# Altium project Analog_Daugther_MAX11331_6U_1v02.PrjPcb (part 2 of 2)

## Sheet Opamps.SchDoc
size A4; Author: Thomas Kreppel; CompanyName: Universidad de Santiago de Chile; Address1: Avenida Ecuador Nº 3519; Address2: Estación Central, Santiago; Address3: Chile; DocumentNumber: 4; Revision: 1v02; SheetNumber: 4; SheetTotal: 6
Used 8 times, as channels OpAmp1, OpAmp2, OpAmp3, OpAmp4, OpAmp5, OpAmp6, OpAmp7, OpAmp8. Parts and nets are listed once, with the designators drawn on the sheet.
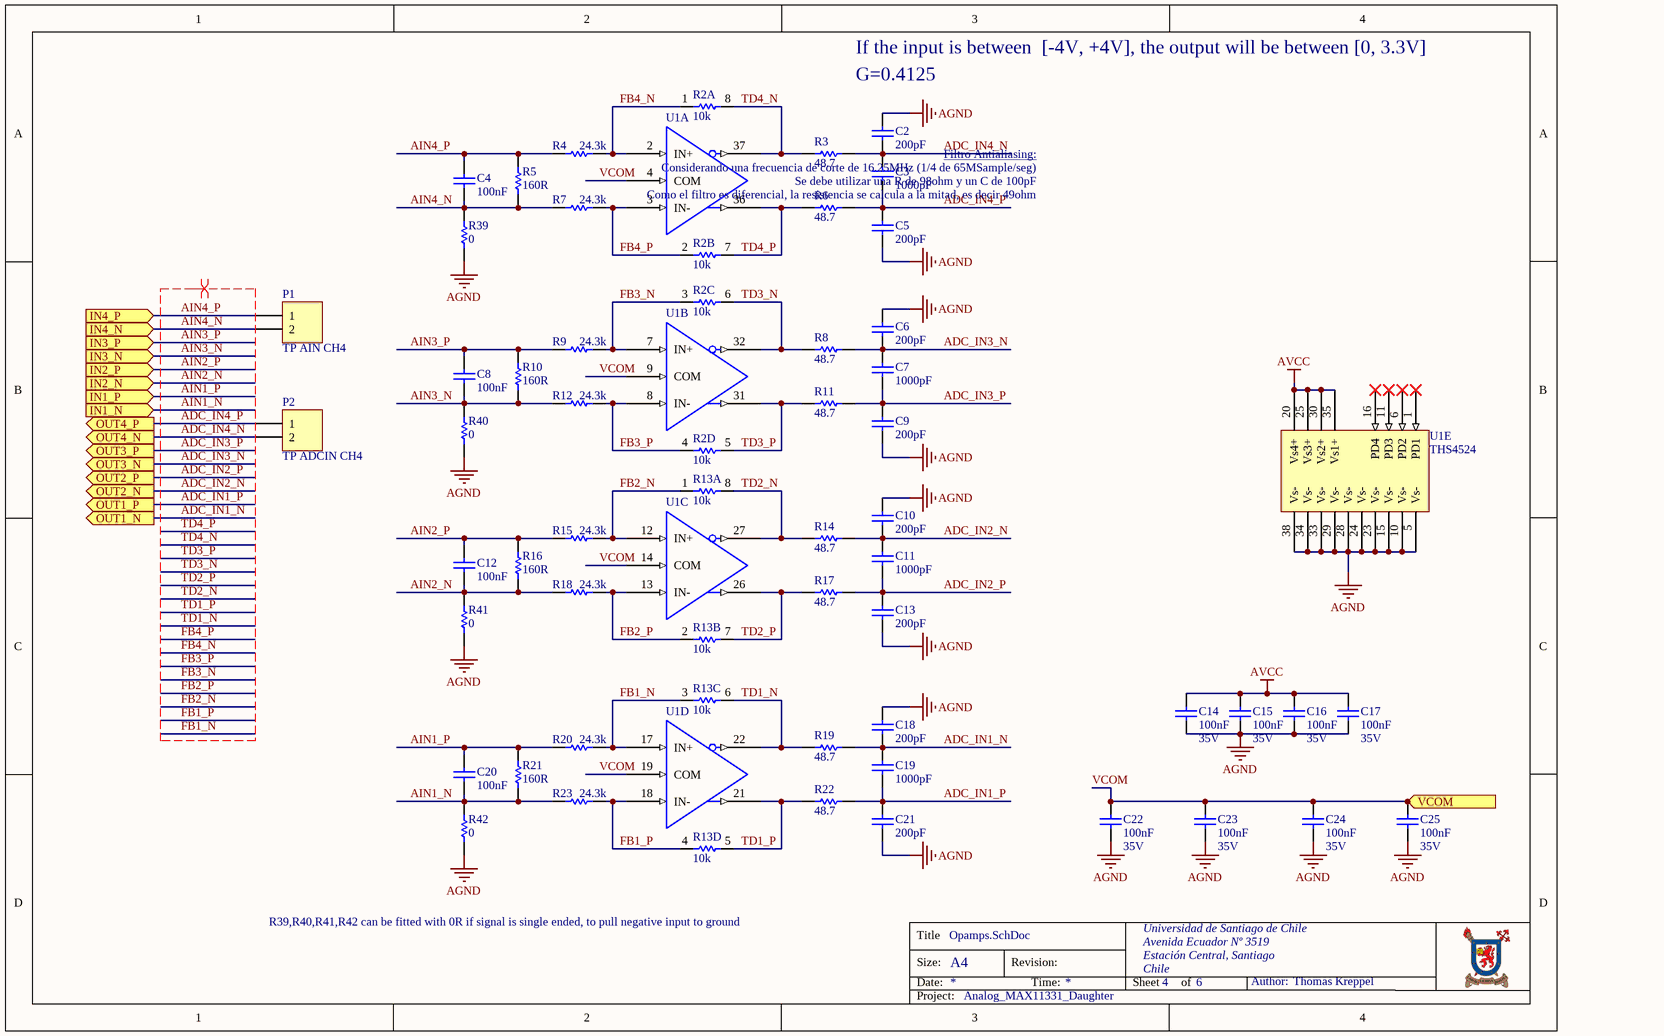
[diagram p5: Opamps.SchDoc]

### Parts
C2  200pF  [CAP_0603]
C3  1000pF  [CAP_0603]
C4  100nF  [RES_1206]
C5  200pF  [CAP_0603]
C6  200pF  [CAP_0603]
C7  1000pF  [CAP_0603]
C8  100nF  [RES_1206]
C9  200pF  [CAP_0603]
C10  200pF  [CAP_0603]
C11  1000pF  [CAP_0603]
C12  100nF  [RES_1206]
C13  200pF  [CAP_0603]
C14  100nF  Voltage: 35V  [CAP_0603]
C15  100nF  Voltage: 35V  [CAP_0603]
C16  100nF  Voltage: 35V  [CAP_0603]
C17  100nF  Voltage: 35V  [CAP_0603]
C18  200pF  [CAP_0603]
C19  1000pF  [CAP_0603]
C20  100nF  [RES_1206]
C21  200pF  [CAP_0603]
C22  100nF  Voltage: 35V  [CAP_0603]
C23  100nF  Voltage: 35V  [CAP_0603]
C24  100nF  Voltage: 35V  [CAP_0603]
C25  100nF  Voltage: 35V  [CAP_0603]
P1  TP AIN CH4  [HDR1X2]  (no BOM)
P2  TP ADCIN CH4  [HDR1X2]  (no BOM)
R2  10k  [CAC-80P320X160-8N]  (parts A,B,C,D of 4)
R3  48.7  [RES_0603]
R4  24.3k  [RES_0603]
R5  160R  [RES_1206]
R6  48.7  [RES_0603]
R7  24.3k  [RES_0603]
R8  48.7  [RES_0603]
R9  24.3k  [RES_0603]
R10  160R  [RES_1206]
R11  48.7  [RES_0603]
R12  24.3k  [RES_0603]
R13  10k  [CAC-80P320X160-8N]  (parts A,B,C,D of 4)
R14  48.7  [RES_0603]
R15  24.3k  [RES_0603]
R16  160R  [RES_1206]
R17  48.7  [RES_0603]
R18  24.3k  [RES_0603]
R19  48.7  [RES_0603]
R20  24.3k  [RES_0603]
R21  160R  [RES_1206]
R22  48.7  [RES_0603]
R23  24.3k  [RES_0603]
R39  0  [RES_0603]
R40  0  [RES_0603]
R41  0  [RES_0603]
R42  0  [RES_0603]
U1  THS4524  [THS4524 Footprint]  (value not drawn)  (parts A,B,C,D,E of 5)

### Ports
IN1_N (in), IN1_P (in), IN2_N (in), IN2_P (in), IN3_N (in), IN3_P (in), IN4_N (in), IN4_P (in), OUT1_N (out), OUT1_P (out), OUT2_N (out), OUT2_P (out), OUT3_N (out), OUT3_P (out), OUT4_N (out), OUT4_P (out), VCOM (in)

### Nets
AGND: C2.1 C5.2 C6.1 C9.2 C10.1 C13.2 C14.2 C15.2 C16.2 C17.2 C18.1 C21.2 C22.1 C23.1 C24.1 C25.1 R39.2 R40.2 R41.2 R42.2 U1.5(Vs-) U1.10(Vs-) U1.15(Vs-) U1.23(Vs-) U1.24(Vs-) U1.28(Vs-) U1.29(Vs-) U1.33(Vs-) U1.34(Vs-) U1.38(Vs-)
AVCC: C14.1 C15.1 C16.1 C17.1 U1.20(Vs4+) U1.25(Vs3+) U1.30(Vs2+) U1.35(Vs1+)
ADC_IN1_N: C18.2 C19.1 R19.1 ; port OUT1_N
ADC_IN1_P: C19.2 C21.1 R22.1 ; port OUT1_P
ADC_IN2_N: C10.2 C11.1 R14.1 ; port OUT2_N
ADC_IN2_P: C11.2 C13.1 R17.1 ; port OUT2_P
ADC_IN3_N: C6.2 C7.1 R8.1 ; port OUT3_N
ADC_IN3_P: C7.2 C9.1 R11.1 ; port OUT3_P
ADC_IN4_N: C2.2 C3.1 P2.2 R3.1 ; port OUT4_N
ADC_IN4_P: C3.2 C5.1 P2.1 R6.1 ; port OUT4_P
AIN1_N: C20.2 R21.2 R23.2 R42.1 ; port IN1_N
AIN1_P: C20.1 R20.2 R21.1 ; port IN1_P
AIN2_N: C12.2 R16.2 R18.2 R41.1 ; port IN2_N
AIN2_P: C12.1 R15.2 R16.1 ; port IN2_P
AIN3_N: C8.2 R10.2 R12.2 R40.1 ; port IN3_N
AIN3_P: C8.1 R9.2 R10.1 ; port IN3_P
AIN4_N: C4.2 P1.2 R5.2 R7.2 R39.1 ; port IN4_N
AIN4_P: C4.1 P1.1 R4.2 R5.1 ; port IN4_P
FB1_N: R13.3 R20.1 U1.17(IN+)
FB1_P: R13.4 R23.1 U1.18(IN-)
FB2_N: R13.1 R15.1 U1.12(IN+)
FB2_P: R13.2 R18.1 U1.13(IN-)
FB3_N: R2.3 R9.1 U1.7(IN+)
FB3_P: R2.4 R12.1 U1.8(IN-)
FB4_N: R2.1 R4.1 U1.2(IN+)
FB4_P: R2.2 R7.1 U1.3(IN-)
TD1_N: R13.6 R19.2 U1.22(OUT-)
TD1_P: R13.5 R22.2 U1.21(OUT+)
TD2_N: R13.8 R14.2 U1.27(OUT-)
TD2_P: R13.7 R17.2 U1.26(OUT+)
TD3_N: R2.6 R8.2 U1.32(OUT-)
TD3_P: R2.5 R11.2 U1.31(OUT+)
TD4_N: R2.8 R3.2 U1.37(OUT-)
TD4_P: R2.7 R6.2 U1.36(OUT+)
VCOM: C22.2 C23.2 C24.2 C25.2 U1.4(COM) U1.9(COM) U1.14(COM) U1.19(COM) ; port VCOM

Not connected (* = marked no-connect by the designer): U1 1(PD1)* 6(PD2)* 11(PD3)* 16(PD4)*

### Channels
OpAmp1: designators end in A; ports IN1_N=AIN1_N IN1_P=AIN1_P IN2_N=AIN2_N IN2_P=AIN2_P IN3_N=AIN3_N IN3_P=AIN3_P IN4_N=AIN4_N IN4_P=AIN4_P OUT1_N=ADC_IN1_N OUT1_P=ADC_IN1_P OUT2_N=ADC_IN2_N OUT2_P=ADC_IN2_P OUT3_N=ADC_IN3_N OUT3_P=ADC_IN3_P OUT4_N=ADC_IN4_N OUT4_P=ADC_IN4_P VCOM=VCOM
OpAmp2: designators end in B; ports IN1_N=AIN1_N IN1_P=AIN1_P IN2_N=AIN2_N IN2_P=AIN2_P IN3_N=AIN3_N IN3_P=AIN3_P IN4_N=AIN4_N IN4_P=AIN4_P OUT1_N=ADC_IN1_N OUT1_P=ADC_IN1_P OUT2_N=ADC_IN2_N OUT2_P=ADC_IN2_P OUT3_N=ADC_IN3_N OUT3_P=ADC_IN3_P OUT4_N=ADC_IN4_N OUT4_P=ADC_IN4_P VCOM=VCOM
OpAmp3: designators end in C; ports IN1_N=AIN1_N IN1_P=AIN1_P IN2_N=AIN2_N IN2_P=AIN2_P IN3_N=AIN3_N IN3_P=AIN3_P IN4_N=AIN4_N IN4_P=AIN4_P OUT1_N=ADC_IN1_N OUT1_P=ADC_IN1_P OUT2_N=ADC_IN2_N OUT2_P=ADC_IN2_P OUT3_N=ADC_IN3_N OUT3_P=ADC_IN3_P OUT4_N=ADC_IN4_N OUT4_P=ADC_IN4_P VCOM=VCOM
OpAmp4: designators end in D; ports IN1_N=AIN1_N IN1_P=AIN1_P IN2_N=AIN2_N IN2_P=AIN2_P IN3_N=AIN3_N IN3_P=AIN3_P IN4_N=AIN4_N IN4_P=AIN4_P OUT1_N=ADC_IN1_N OUT1_P=ADC_IN1_P OUT2_N=ADC_IN2_N OUT2_P=ADC_IN2_P OUT3_N=ADC_IN3_N OUT3_P=ADC_IN3_P OUT4_N=ADC_IN4_N OUT4_P=ADC_IN4_P VCOM=VCOM
OpAmp5: designators end in E; ports IN1_N=AIN1_N IN1_P=AIN1_P IN2_N=AIN2_N IN2_P=AIN2_P IN3_N=AIN3_N IN3_P=AIN3_P IN4_N=AIN4_N IN4_P=AIN4_P OUT1_N=ADC_IN1_N OUT1_P=ADC_IN1_P OUT2_N=ADC_IN2_N OUT2_P=ADC_IN2_P OUT3_N=ADC_IN3_N OUT3_P=ADC_IN3_P OUT4_N=ADC_IN4_N OUT4_P=ADC_IN4_P VCOM=VCOM
OpAmp6: designators end in F; ports IN1_N=AIN1_N IN1_P=AIN1_P IN2_N=AIN2_N IN2_P=AIN2_P IN3_N=AIN3_N IN3_P=AIN3_P IN4_N=AIN4_N IN4_P=AIN4_P OUT1_N=ADC_IN1_N OUT1_P=ADC_IN1_P OUT2_N=ADC_IN2_N OUT2_P=ADC_IN2_P OUT3_N=ADC_IN3_N OUT3_P=ADC_IN3_P OUT4_N=ADC_IN4_N OUT4_P=ADC_IN4_P VCOM=VCOM
OpAmp7: designators end in G; ports IN1_N=AIN1_N IN1_P=AIN1_P IN2_N=AIN2_N IN2_P=AIN2_P IN3_N=AIN3_N IN3_P=AIN3_P IN4_N=AIN4_N IN4_P=AIN4_P OUT1_N=ADC_IN1_N OUT1_P=ADC_IN1_P OUT2_N=ADC_IN2_N OUT2_P=ADC_IN2_P OUT3_N=ADC_IN3_N OUT3_P=ADC_IN3_P OUT4_N=ADC_IN4_N OUT4_P=ADC_IN4_P VCOM=VCOM
OpAmp8: designators end in H; ports IN1_N=AIN1_N IN1_P=AIN1_P IN2_N=AIN2_N IN2_P=AIN2_P IN3_N=AIN3_N IN3_P=AIN3_P IN4_N=AIN4_N IN4_P=AIN4_P OUT1_N=ADC_IN1_N OUT1_P=ADC_IN1_P OUT2_N=ADC_IN2_N OUT2_P=ADC_IN2_P OUT3_N=ADC_IN3_N OUT3_P=ADC_IN3_P OUT4_N=ADC_IN4_N OUT4_P=ADC_IN4_P VCOM=VCOM

### Layout directives
differential pair: ADC_IN1_N, ADC_IN1_P, ADC_IN2_N, ADC_IN2_P, ADC_IN3_N, ADC_IN3_P, ADC_IN4_N, ADC_IN4_P, AIN1_N, AIN1_P, AIN2_N, AIN2_P, AIN3_N, AIN3_P, AIN4_N, AIN4_P, FB1_N, FB1_P, FB2_N, FB2_P, FB3_N, FB3_P, FB4_N, FB4_P, TD1_N, TD1_P, TD2_N, TD2_P, TD3_N, TD3_P, TD4_N, TD4_P

### Notes on the sheet
- (near C2) G=0.4125
- If the input is between  [-4V, +4V], the output will be between [0, 3.3V]
- Considerando una frecuencia de corte de 16.25MHz (1/4 de 65MSample/seg)
- Se debe utilizar una R de 98ohm y un C de 100pF
- Filtro Antialiasing:
- Como el filtro es diferencial, la resistencia se calcula a la mitad, es decir 49ohm
- R39,R40,R41,R42 can be fitted with 0R if signal is single ended, to pull negative input to ground
- Title
- Size:
- Date:
- A4
- Revision:
- Time:
- Sheet
- of
- Author:
- Project:

### Library data of the parts
C2 C5 C6 C9 C10 C13 C18 C21 = Cap_0603: Capacitor; MPN: 0603N201J500CT; Rule: PcbType=ProtelPcb; MF: Walsin; Voltage: 16V; Dielectricum: CG0; Tolerance: 5%; Published: 8-Jun-2000; LatestRevisionDate: 17-Jul-2002; LatestRevisionNote: Re-released for DXP Platform.; PackageReference: RAD-0.3; Publisher: Altium Limited; Value: 200pF; Supplier Part Number 1: 1292-1499-1-ND; Supplier 1: Digikey; Package: 0603; LCSC Part Number: C458897
C3 C7 C11 C19 = Cap_0603: Capacitor; MPN: 885012006029; Rule: PcbType=ProtelPcb; MF: Würth Elektronik; Voltage: 16V; Dielectricum: CG0; Tolerance: 5%; Published: 8-Jun-2000; LatestRevisionDate: 17-Jul-2002; LatestRevisionNote: Re-released for DXP Platform.; PackageReference: RAD-0.3; Publisher: Altium Limited; Value: 1000pF; Supplier Part Number 1: 732-7771-1-ND; Supplier 1: Digikey; Package: 0603; LCSC Part Number: C6715067
C4 C8 C12 C20 = Cap_1206: Capacitor; MPN: C1206C104K3RACTU; Voltage: 16V; MF: KEMET; Dielectricum: X7R; Tolerance: 10%; Supplier Part Number 1: 399-8140-1-ND; Value: 100nF; Supplier 1: Digikey; Package: 1206; LCSC Part Number: C2168906
C14-C17 C22-C25 = Cap_0603: Capacitor; MPN: C0603C104M5RACTU; Rule: PcbType=ProtelPcb; MF: KEMET; Dielectricum: X7R; Tolerance: 10%; Published: 8-Jun-2000; LatestRevisionDate: 17-Jul-2002; LatestRevisionNote: Re-released for DXP Platform.; PackageReference: RAD-0.3; Publisher: Altium Limited; Value: 100nF; Supplier Part Number 1: 399-7845-1-ND; Supplier 1: Digikey; Package: 0603; LCSC Part Number: C14663
P1 P2 = Header 2: Header, 2-Pin; LatestRevisionDate: 17-Jul-2002; LatestRevisionNote: Re-released for DXP Platform.; Publisher: Altium Limited
R2 R13 = ResArray 1206: Chip Resistor Array 0606, 4xR; MPN: ACASA1002S1002P100; MF: Vishay; Value: 10k; Created: Kreppel_0420; Supplier 1: Digikey; Supplier Part Number 1: 749-1023-1-ND; LCSC Part Number: C2654165
R3 R6 R8 R11 R14 R17 R19 R22 = Res0603: MPN: ERA-3AEB48R7V; MF: Panasonic; Tolerance: 0.1%; Published: 8-Jun-2000; LatestRevisionDate: 17-Jul-2002; LatestRevisionNote: Re-released for DXP Platform.; PackageReference: AXIAL-0.3; Publisher: Altium Limited; PackageDescription: Axial Device, Thru-Hole; 2 Leads; 0.3 in Pin Spacing; Supplier Part Number 1: P48.7DBCT-ND; Value: 48.7; Supplier 1: Digikey; Package: 0603; LCSC Part Number: C3951932
R4 R7 R9 R12 R15 R18 R20 R23 = Res0603: MPN: ERJ-PB3B2432V; MF: Panasonic; Tolerance: 0.1%; Published: 8-Jun-2000; LatestRevisionDate: 17-Jul-2002; LatestRevisionNote: Re-released for DXP Platform.; PackageReference: AXIAL-0.3; Publisher: Altium Limited; PackageDescription: Axial Device, Thru-Hole; 2 Leads; 0.3 in Pin Spacing; Supplier Part Number 1: P20128CT-ND; Value: 24.3k; Supplier 1: Digikey; Package: 0603; LCSC Part Number: C2087018
R5 R10 R16 R21 = Res Semi: Limiter Resistor; MPN: RT1206BRD07160RL; MF: Yageo; Tolerance: 0.1%; Published: 8-Jun-2000; LatestRevisionDate: 17-Jul-2002; LatestRevisionNote: Re-released for DXP Platform.; PackageReference: AXIAL-0.5; Publisher: Altium Limited; PackageDescription: Axial Device, Thru-Hole; 2 Leads; 0.5 in Pin Spacing; Value: 160R; Supplier Part Number 1: YAG2013CT-ND; Supplier 1: Digikey; Package: 1206; LCSC Part Number: C870442
R39-R42 = Res0603: MPN: RC0603JR-070RL; MF: Yageo; Tolerance: 1%; Published: 8-Jun-2000; LatestRevisionDate: 17-Jul-2002; LatestRevisionNote: Re-released for DXP Platform.; PackageReference: AXIAL-0.3; Publisher: Altium Limited; PackageDescription: Axial Device, Thru-Hole; 2 Leads; 0.3 in Pin Spacing; Value: 0; Supplier 1: Digikey; Supplier 2: Mouser; Supplier Part Number 1: 311-0.0GRCT-ND; Package: 0603
U1 = THS4524_1: Quad Channel fully differential Amplilfier; MF: Texas Instruments; Created: 20190720_Kreppel; MPN: THS4524; Package: TSSOP-38; Supplier 1: Digikey; Supplier Part Number 1: 296-24315-1-ND; LCSC Part Number: C2057434

## Nets that join several sheets
AGND: Analog Inputs (C1.2 R1.2), Power supplies (BS5.2 TP5.1), ADC1 (10 pins), OpAmp1 (30 pins), OpAmp2 (30 pins), ADC2 (10 pins), OpAmp3 (30 pins), OpAmp4 (30 pins), ADC3 (10 pins), ADC4 (10 pins), OpAmp5 (30 pins), OpAmp6 (30 pins), OpAmp7 (30 pins), OpAmp8 (30 pins)
AVCC: Power supplies (BS3.2 TP14.1), ADC1 (7 pins), OpAmp1 (8 pins), OpAmp2 (8 pins), ADC2 (7 pins), OpAmp3 (8 pins), OpAmp4 (8 pins), ADC3 (7 pins), ADC4 (7 pins), OpAmp5 (8 pins), OpAmp6 (8 pins), OpAmp7 (8 pins), OpAmp8 (8 pins)
DGND: Interface Connector (14 pins), Power supplies (BS4.1 TP3.1), ADC1 (C30A.2 C33A.2 C34A.2 U2A.25), ADC2 (C30B.2 C33B.2 C34B.2 U2B.25), ADC3 (C30C.2 C33C.2 C34C.2 U2C.25), ADC4 (C30D.2 C33D.2 C34D.2 U2D.25)
DVCC: Interface Connector (17 pins), Power supplies (BS2.1 D1.2), ADC1 (C33A.1 C34A.1 U2A.26), ADC2 (C33B.1 C34B.1 U2B.26), ADC3 (C33C.1 C34C.1 U2C.26), ADC4 (C33D.1 C34D.1 U2D.26)
ADC_IN1_N: ADC1 (U2A.4), OpAmp2 (C18B.2 C19B.1 R19B.1)
ADC_IN1_N: ADC1 (U2A.16), OpAmp1 (C18A.2 C19A.1 R19A.1)
ADC_IN1_N: ADC2 (U2B.4), OpAmp4 (C18D.2 C19D.1 R19D.1)
ADC_IN1_N: ADC2 (U2B.16), OpAmp3 (C18C.2 C19C.1 R19C.1)
ADC_IN1_N: ADC3 (U2C.4), OpAmp6 (C18F.2 C19F.1 R19F.1)
ADC_IN1_N: ADC3 (U2C.16), OpAmp5 (C18E.2 C19E.1 R19E.1)
ADC_IN1_N: ADC4 (U2D.4), OpAmp8 (C18H.2 C19H.1 R19H.1)
ADC_IN1_N: ADC4 (U2D.16), OpAmp7 (C18G.2 C19G.1 R19G.1)
ADC_IN1_P: ADC1 (U2A.3), OpAmp2 (C19B.2 C21B.1 R22B.1)
ADC_IN1_P: ADC1 (U2A.15), OpAmp1 (C19A.2 C21A.1 R22A.1)
ADC_IN1_P: ADC2 (U2B.3), OpAmp4 (C19D.2 C21D.1 R22D.1)
ADC_IN1_P: ADC2 (U2B.15), OpAmp3 (C19C.2 C21C.1 R22C.1)
ADC_IN1_P: ADC3 (U2C.3), OpAmp6 (C19F.2 C21F.1 R22F.1)
ADC_IN1_P: ADC3 (U2C.15), OpAmp5 (C19E.2 C21E.1 R22E.1)
ADC_IN1_P: ADC4 (U2D.3), OpAmp8 (C19H.2 C21H.1 R22H.1)
ADC_IN1_P: ADC4 (U2D.15), OpAmp7 (C19G.2 C21G.1 R22G.1)
ADC_IN2_N: ADC1 (U2A.2), OpAmp2 (C10B.2 C11B.1 R14B.1)
ADC_IN2_N: ADC1 (U2A.10), OpAmp1 (C10A.2 C11A.1 R14A.1)
ADC_IN2_N: ADC2 (U2B.2), OpAmp4 (C10D.2 C11D.1 R14D.1)
ADC_IN2_N: ADC2 (U2B.10), OpAmp3 (C10C.2 C11C.1 R14C.1)
ADC_IN2_N: ADC3 (U2C.2), OpAmp6 (C10F.2 C11F.1 R14F.1)
ADC_IN2_N: ADC3 (U2C.10), OpAmp5 (C10E.2 C11E.1 R14E.1)
ADC_IN2_N: ADC4 (U2D.2), OpAmp8 (C10H.2 C11H.1 R14H.1)
ADC_IN2_N: ADC4 (U2D.10), OpAmp7 (C10G.2 C11G.1 R14G.1)
ADC_IN2_P: ADC1 (U2A.1), OpAmp2 (C11B.2 C13B.1 R17B.1)
ADC_IN2_P: ADC1 (U2A.9), OpAmp1 (C11A.2 C13A.1 R17A.1)
ADC_IN2_P: ADC2 (U2B.1), OpAmp4 (C11D.2 C13D.1 R17D.1)
ADC_IN2_P: ADC2 (U2B.9), OpAmp3 (C11C.2 C13C.1 R17C.1)
ADC_IN2_P: ADC3 (U2C.1), OpAmp6 (C11F.2 C13F.1 R17F.1)
ADC_IN2_P: ADC3 (U2C.9), OpAmp5 (C11E.2 C13E.1 R17E.1)
ADC_IN2_P: ADC4 (U2D.1), OpAmp8 (C11H.2 C13H.1 R17H.1)
ADC_IN2_P: ADC4 (U2D.9), OpAmp7 (C11G.2 C13G.1 R17G.1)
ADC_IN3_N: ADC1 (U2A.32), OpAmp2 (C6B.2 C7B.1 R8B.1)
ADC_IN3_N: ADC1 (U2A.8), OpAmp1 (C6A.2 C7A.1 R8A.1)
ADC_IN3_N: ADC2 (U2B.32), OpAmp4 (C6D.2 C7D.1 R8D.1)
ADC_IN3_N: ADC2 (U2B.8), OpAmp3 (C6C.2 C7C.1 R8C.1)
ADC_IN3_N: ADC3 (U2C.32), OpAmp6 (C6F.2 C7F.1 R8F.1)
ADC_IN3_N: ADC3 (U2C.8), OpAmp5 (C6E.2 C7E.1 R8E.1)
ADC_IN3_N: ADC4 (U2D.32), OpAmp8 (C6H.2 C7H.1 R8H.1)
ADC_IN3_N: ADC4 (U2D.8), OpAmp7 (C6G.2 C7G.1 R8G.1)
ADC_IN3_P: ADC1 (U2A.31), OpAmp2 (C7B.2 C9B.1 R11B.1)
ADC_IN3_P: ADC1 (U2A.7), OpAmp1 (C7A.2 C9A.1 R11A.1)
ADC_IN3_P: ADC2 (U2B.31), OpAmp4 (C7D.2 C9D.1 R11D.1)
ADC_IN3_P: ADC2 (U2B.7), OpAmp3 (C7C.2 C9C.1 R11C.1)
ADC_IN3_P: ADC3 (U2C.31), OpAmp6 (C7F.2 C9F.1 R11F.1)
ADC_IN3_P: ADC3 (U2C.7), OpAmp5 (C7E.2 C9E.1 R11E.1)
ADC_IN3_P: ADC4 (U2D.31), OpAmp8 (C7H.2 C9H.1 R11H.1)
ADC_IN3_P: ADC4 (U2D.7), OpAmp7 (C7G.2 C9G.1 R11G.1)
ADC_IN4_N: ADC1 (U2A.30), OpAmp2 (C2B.2 C3B.1 P2B.2 R3B.1)
ADC_IN4_N: ADC1 (U2A.6), OpAmp1 (C2A.2 C3A.1 P2A.2 R3A.1)
ADC_IN4_N: ADC2 (U2B.30), OpAmp4 (C2D.2 C3D.1 P2D.2 R3D.1)
ADC_IN4_N: ADC2 (U2B.6), OpAmp3 (C2C.2 C3C.1 P2C.2 R3C.1)
ADC_IN4_N: ADC3 (U2C.30), OpAmp6 (C2F.2 C3F.1 P2F.2 R3F.1)
ADC_IN4_N: ADC3 (U2C.6), OpAmp5 (C2E.2 C3E.1 P2E.2 R3E.1)
ADC_IN4_N: ADC4 (U2D.30), OpAmp8 (C2H.2 C3H.1 P2H.2 R3H.1)
ADC_IN4_N: ADC4 (U2D.6), OpAmp7 (C2G.2 C3G.1 P2G.2 R3G.1)
ADC_IN4_P: ADC1 (U2A.29), OpAmp2 (C3B.2 C5B.1 P2B.1 R6B.1)
ADC_IN4_P: ADC1 (U2A.5), OpAmp1 (C3A.2 C5A.1 P2A.1 R6A.1)
ADC_IN4_P: ADC2 (U2B.29), OpAmp4 (C3D.2 C5D.1 P2D.1 R6D.1)
ADC_IN4_P: ADC2 (U2B.5), OpAmp3 (C3C.2 C5C.1 P2C.1 R6C.1)
ADC_IN4_P: ADC3 (U2C.29), OpAmp6 (C3F.2 C5F.1 P2F.1 R6F.1)
ADC_IN4_P: ADC3 (U2C.5), OpAmp5 (C3E.2 C5E.1 P2E.1 R6E.1)
ADC_IN4_P: ADC4 (U2D.29), OpAmp8 (C3H.2 C5H.1 P2H.1 R6H.1)
ADC_IN4_P: ADC4 (U2D.5), OpAmp7 (C3G.2 C5G.1 P2G.1 R6G.1)
AIN1_N: Analog Inputs (J1.A8), OpAmp7 (C20G.2 R21G.2 R23G.2 R42G.1)
AIN1_N: Analog Inputs (J1.B8), OpAmp5 (C20E.2 R21E.2 R23E.2 R42E.1)
AIN1_N: Analog Inputs (J1.C8), OpAmp3 (C20C.2 R21C.2 R23C.2 R42C.1)
AIN1_N: Analog Inputs (J1.D8), OpAmp1 (C20A.2 R21A.2 R23A.2 R42A.1)
AIN1_N: Analog Inputs (J1.E2), OpAmp2 (C20B.2 R21B.2 R23B.2 R42B.1)
AIN1_N: Analog Inputs (J1.F2), OpAmp4 (C20D.2 R21D.2 R23D.2 R42D.1)
AIN1_N: Analog Inputs (J1.G2), OpAmp6 (C20F.2 R21F.2 R23F.2 R42F.1)
AIN1_N: Analog Inputs (J1.H2), OpAmp8 (C20H.2 R21H.2 R23H.2 R42H.1)
AIN1_P: Analog Inputs (J1.A7), OpAmp7 (C20G.1 R20G.2 R21G.1)
AIN1_P: Analog Inputs (J1.B7), OpAmp5 (C20E.1 R20E.2 R21E.1)
AIN1_P: Analog Inputs (J1.C7), OpAmp3 (C20C.1 R20C.2 R21C.1)
AIN1_P: Analog Inputs (J1.D7), OpAmp1 (C20A.1 R20A.2 R21A.1)
AIN1_P: Analog Inputs (J1.E1), OpAmp2 (C20B.1 R20B.2 R21B.1)
AIN1_P: Analog Inputs (J1.F1), OpAmp4 (C20D.1 R20D.2 R21D.1)
AIN1_P: Analog Inputs (J1.G1), OpAmp6 (C20F.1 R20F.2 R21F.1)
AIN1_P: Analog Inputs (J1.H1), OpAmp8 (C20H.1 R20H.2 R21H.1)
AIN2_N: Analog Inputs (J1.A6), OpAmp7 (C12G.2 R16G.2 R18G.2 R41G.1)
AIN2_N: Analog Inputs (J1.B6), OpAmp5 (C12E.2 R16E.2 R18E.2 R41E.1)
AIN2_N: Analog Inputs (J1.C6), OpAmp3 (C12C.2 R16C.2 R18C.2 R41C.1)
AIN2_N: Analog Inputs (J1.D6), OpAmp1 (C12A.2 R16A.2 R18A.2 R41A.1)
AIN2_N: Analog Inputs (J1.E6), OpAmp2 (C12B.2 R16B.2 R18B.2 R41B.1)
AIN2_N: Analog Inputs (J1.F6), OpAmp4 (C12D.2 R16D.2 R18D.2 R41D.1)
AIN2_N: Analog Inputs (J1.G6), OpAmp6 (C12F.2 R16F.2 R18F.2 R41F.1)
AIN2_N: Analog Inputs (J1.H6), OpAmp8 (C12H.2 R16H.2 R18H.2 R41H.1)
AIN2_P: Analog Inputs (J1.A3), OpAmp7 (C12G.1 R15G.2 R16G.1)
AIN2_P: Analog Inputs (J1.B3), OpAmp5 (C12E.1 R15E.2 R16E.1)
AIN2_P: Analog Inputs (J1.C3), OpAmp3 (C12C.1 R15C.2 R16C.1)
AIN2_P: Analog Inputs (J1.D3), OpAmp1 (C12A.1 R15A.2 R16A.1)
AIN2_P: Analog Inputs (J1.E3), OpAmp2 (C12B.1 R15B.2 R16B.1)
AIN2_P: Analog Inputs (J1.F3), OpAmp4 (C12D.1 R15D.2 R16D.1)
AIN2_P: Analog Inputs (J1.G3), OpAmp6 (C12F.1 R15F.2 R16F.1)
AIN2_P: Analog Inputs (J1.H3), OpAmp8 (C12H.1 R15H.2 R16H.1)
AIN3_N: Analog Inputs (J1.A5), OpAmp7 (C8G.2 R10G.2 R12G.2 R40G.1)
AIN3_N: Analog Inputs (J1.B5), OpAmp5 (C8E.2 R10E.2 R12E.2 R40E.1)
AIN3_N: Analog Inputs (J1.C5), OpAmp3 (C8C.2 R10C.2 R12C.2 R40C.1)
AIN3_N: Analog Inputs (J1.D5), OpAmp1 (C8A.2 R10A.2 R12A.2 R40A.1)
AIN3_N: Analog Inputs (J1.E5), OpAmp2 (C8B.2 R10B.2 R12B.2 R40B.1)
AIN3_N: Analog Inputs (J1.F5), OpAmp4 (C8D.2 R10D.2 R12D.2 R40D.1)
AIN3_N: Analog Inputs (J1.G5), OpAmp6 (C8F.2 R10F.2 R12F.2 R40F.1)
AIN3_N: Analog Inputs (J1.H5), OpAmp8 (C8H.2 R10H.2 R12H.2 R40H.1)
AIN3_P: Analog Inputs (J1.A4), OpAmp7 (C8G.1 R9G.2 R10G.1)
AIN3_P: Analog Inputs (J1.B4), OpAmp5 (C8E.1 R9E.2 R10E.1)
AIN3_P: Analog Inputs (J1.C4), OpAmp3 (C8C.1 R9C.2 R10C.1)
AIN3_P: Analog Inputs (J1.D4), OpAmp1 (C8A.1 R9A.2 R10A.1)
AIN3_P: Analog Inputs (J1.E4), OpAmp2 (C8B.1 R9B.2 R10B.1)
AIN3_P: Analog Inputs (J1.F4), OpAmp4 (C8D.1 R9D.2 R10D.1)
AIN3_P: Analog Inputs (J1.G4), OpAmp6 (C8F.1 R9F.2 R10F.1)
AIN3_P: Analog Inputs (J1.H4), OpAmp8 (C8H.1 R9H.2 R10H.1)
AIN4_N: Analog Inputs (J1.A2), OpAmp7 (5 pins)
AIN4_N: Analog Inputs (J1.B2), OpAmp5 (5 pins)
AIN4_N: Analog Inputs (J1.C2), OpAmp3 (5 pins)
AIN4_N: Analog Inputs (J1.D2), OpAmp1 (5 pins)
AIN4_N: Analog Inputs (J1.E8), OpAmp2 (5 pins)
AIN4_N: Analog Inputs (J1.F8), OpAmp4 (5 pins)
AIN4_N: Analog Inputs (J1.G8), OpAmp6 (5 pins)
AIN4_N: Analog Inputs (J1.H8), OpAmp8 (5 pins)
AIN4_P: Analog Inputs (J1.A1), OpAmp7 (C4G.1 P1G.1 R4G.2 R5G.1)
AIN4_P: Analog Inputs (J1.B1), OpAmp5 (C4E.1 P1E.1 R4E.2 R5E.1)
AIN4_P: Analog Inputs (J1.C1), OpAmp3 (C4C.1 P1C.1 R4C.2 R5C.1)
AIN4_P: Analog Inputs (J1.D1), OpAmp1 (C4A.1 P1A.1 R4A.2 R5A.1)
AIN4_P: Analog Inputs (J1.E7), OpAmp2 (C4B.1 P1B.1 R4B.2 R5B.1)
AIN4_P: Analog Inputs (J1.F7), OpAmp4 (C4D.1 P1D.1 R4D.2 R5D.1)
AIN4_P: Analog Inputs (J1.G7), OpAmp6 (C4F.1 P1F.1 R4F.2 R5F.1)
AIN4_P: Analog Inputs (J1.H7), OpAmp8 (C4H.1 P1H.1 R4H.2 R5H.1)
CSA: Interface Connector (U7.3), ADC1 (U2A.23)
CSB: Interface Connector (U7.8), ADC2 (U2B.23)
CSC: Interface Connector (U7.7), ADC3 (U2C.23)
CSD: Interface Connector (U7.5), ADC4 (U2D.23)
MISOA: Interface Connector (TP8.1 U6.1), ADC1 (U2A.27)
MISOB: Interface Connector (TP9.1 U6.7), ADC2 (U2B.27)
MISOC: Interface Connector (TP10.1 U6.9), ADC3 (U2C.27)
MISOD: Interface Connector (TP12.1 U6.15), ADC4 (U2D.27)
MOSIA: Interface Connector (U5.3), ADC1 (U2A.24)
MOSIB: Interface Connector (U5.8), ADC2 (U2B.24)
MOSIC: Interface Connector (U5.7), ADC3 (U2C.24)
MOSID: Interface Connector (U5.5), ADC4 (U2D.24)
SCLKA: Interface Connector (U4.3), ADC1 (U2A.22)
SCLKB: Interface Connector (U4.8), ADC2 (U2B.22)
SCLKC: Interface Connector (U4.7), ADC3 (U2C.22)
SCLKD: Interface Connector (R24.1 U4.5), ADC4 (U2D.22)
VCOM: ADC1 (C31A.1 REF1A.1), OpAmp1 (8 pins), OpAmp2 (8 pins)
VCOM: ADC2 (C31B.1 REF1B.1), OpAmp3 (8 pins), OpAmp4 (8 pins)
VCOM: ADC3 (C31C.1 REF1C.1), OpAmp5 (8 pins), OpAmp6 (8 pins)
VCOM: ADC4 (C31D.1 REF1D.1), OpAmp7 (8 pins), OpAmp8 (8 pins)

## Assembly variants
No_CLK_RTN: not fitted C1 C37 R1 R24 R39A R39B R39C R39D R39E R39F R39G R39H R40A R40B R40C R40D R40E R40F R40G R40H R41A R41B R41C R41D R41E R41F R41G R41H R42A R42B R42C R42D R42E R42F R42G R42H TP1 TP2 TP3 TP4 TP5 TP6 TP7 TP8 TP9 TP10 TP11 TP12 TP13 U8